# Altium schematic sheet SH23 - AIC PHONE AIC.SchDoc
size 386 x 246 mm
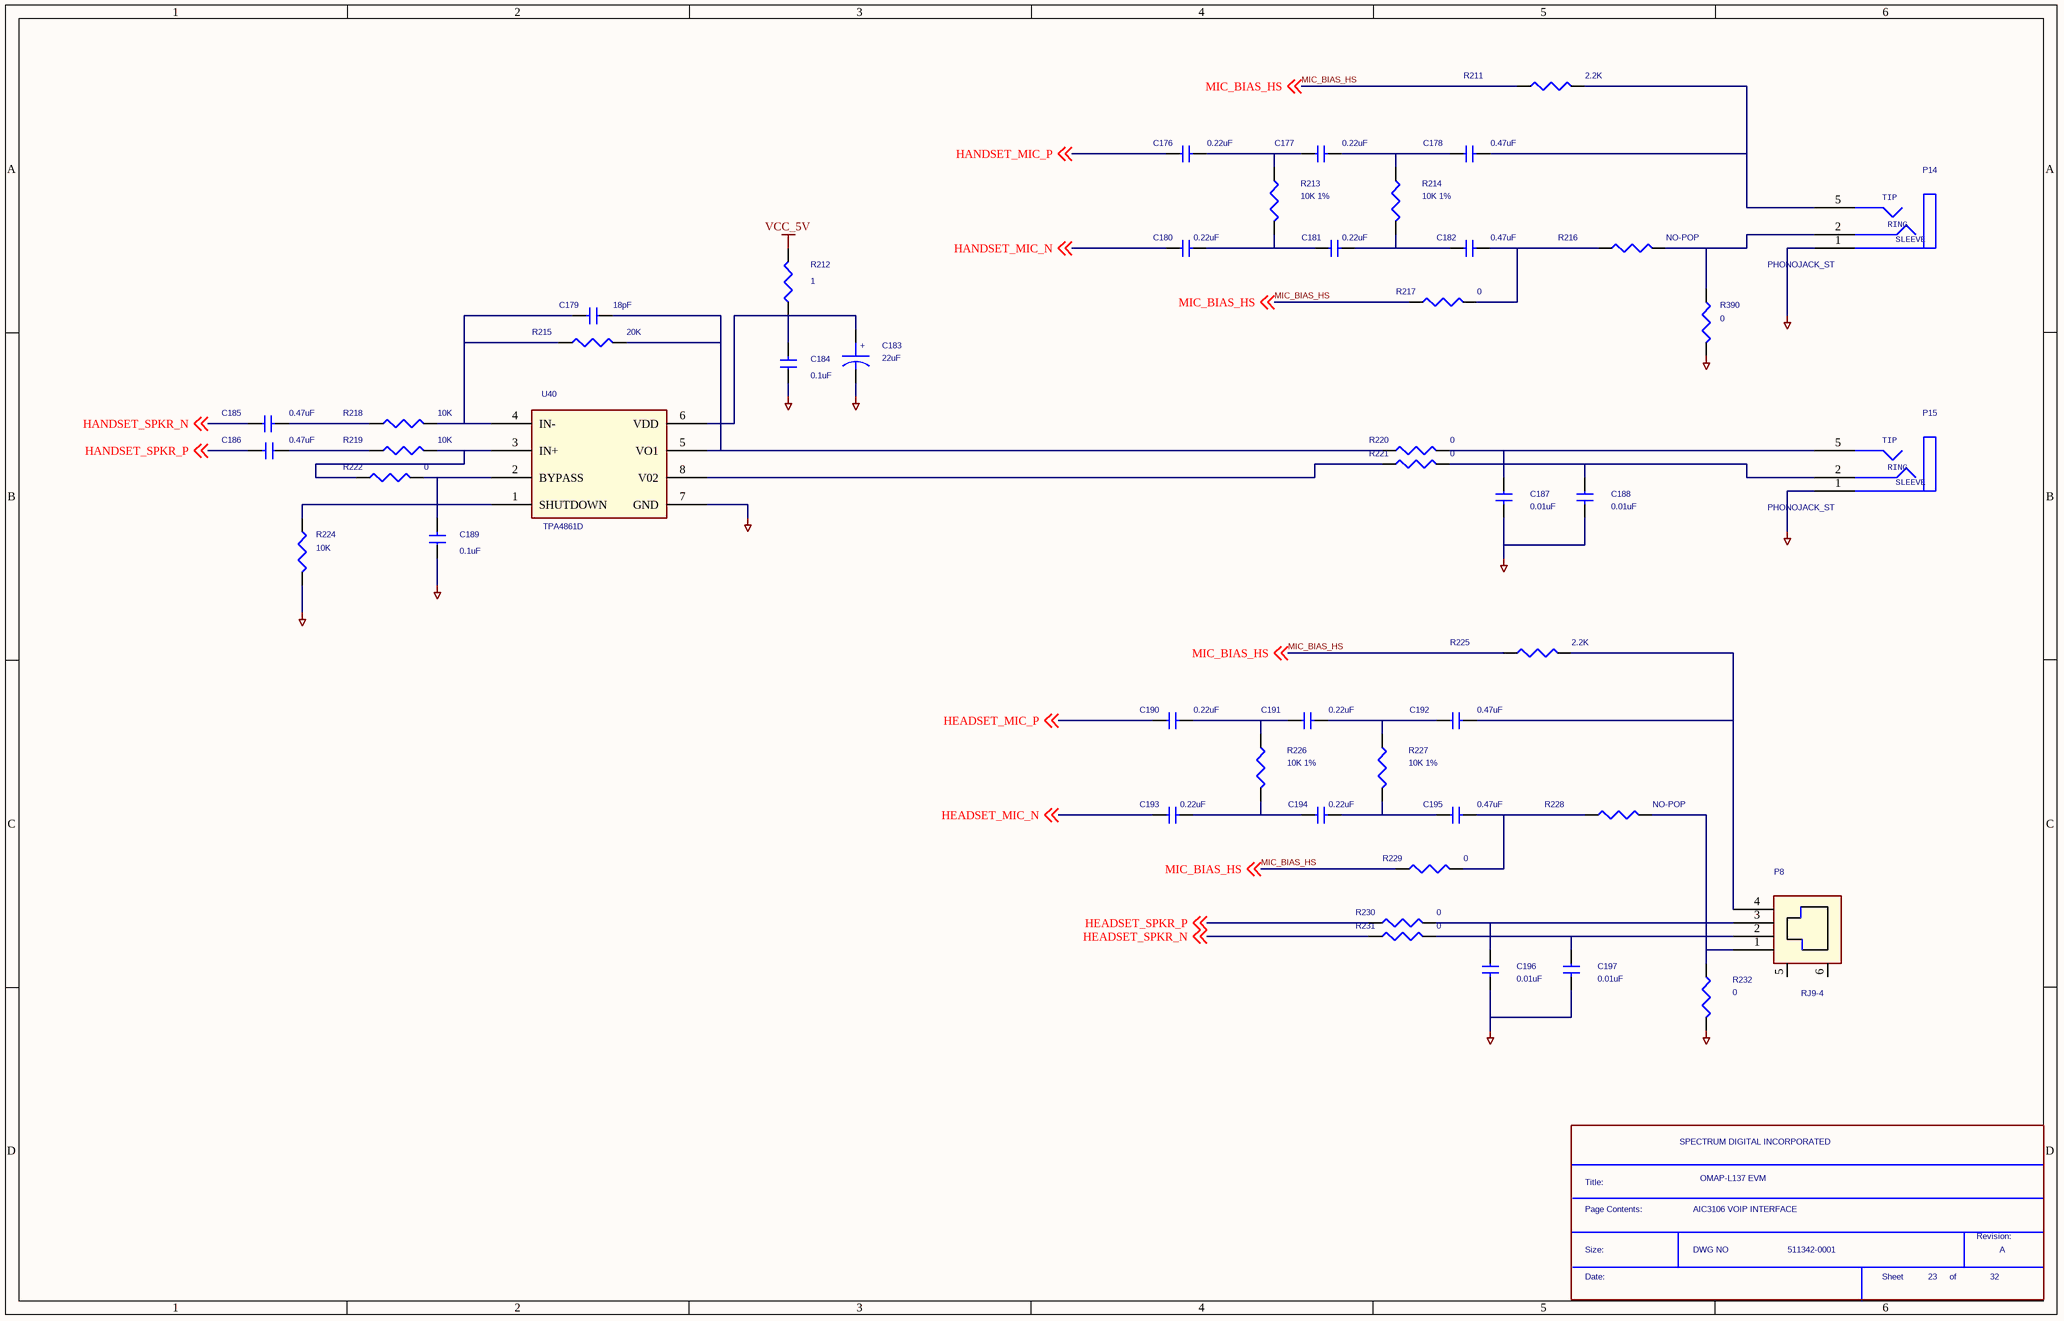
[diagram p0: SH23 - AIC PHONE AIC.SchDoc]

## Parts
*  Page Contents:: AIC3106 VOIP INTERFACE  RevCode: A  Title: OMAP-L137 EVM  OrgName: SPECTRUM DIGITAL INCORPORATED  Doc: 511342-0001  Page Number: 23  Page Count: 32  (hidden comment: SDTitleBlock)  (graphical)
C176  0.22uF  [c603-35x45]
C177  0.22uF  [c603-35x45]
C178  0.47uF  [c603-35x45]
C179  18pF  [c603-35x45]
C180  0.22uF  [c603-35x45]
C181  0.22uF  [c603-35x45]
C182  0.47uF  [c603-35x45]
C183  22uF  [C1206-40X70]
C184  0.1uF  [c402-25]
C185  0.47uF  [c603-35x45]
C186  0.47uF  [c603-35x45]
C187  0.01uF  [c402-25]
C188  0.01uF  [c402-25]
C189  0.1uF  [c402-25]
C190  0.22uF  [c603-35x45]
C191  0.22uF  [c603-35x45]
C192  0.47uF  [c603-35x45]
C193  0.22uF  [c603-35x45]
C194  0.22uF  [c603-35x45]
C195  0.47uF  [c603-35x45]
C196  0.01uF  [c402-25]
C197  0.01uF  [c402-25]
P8  RJ9-4  [molex-52018]
P14  PHONOJACK_ST  [cui3533-10070]
P15  PHONOJACK_ST  [cui3533-10070]
R211  2.2K  [r402-25]
R212  1  [r603-35X45]
R213  10K 1%  [r402-25]
R214  10K 1%  [r402-25]
R215  20K  [r402-25]
R216  NO-POP  [r402-25]
R217  0  [r402-25]
R218  10K  [r402-25]
R219  10K  [r402-25]
R220  0  [r402-25]
R221  0  [r402-25]
R222  0  [r402-25]
R224  10K  [r402-25]
R225  2.2K  [r402-25]
R226  10K 1%  [r402-25]
R227  10K 1%  [r402-25]
R228  NO-POP  [r402-25]
R229  0  [r402-25]
R230  0  [r402-25]
R231  0  [r402-25]
R232  0  [r402-25]
R390  0  [r402-25]
U40  TPA4861D  [so8-25x75]

## Nets
GND_AIC: C183.2 C184.1 C187.2 C188.2 C189.1 C196.2 C197.2 P14.1 P15.1 R224.2 R232.2 R390.2 U40.7(GND)
VCC_5V: R212.2
HANDSET_MIC_N: C180.1 ; off-sheet HANDSET_MIC_N
HANDSET_MIC_P: C176.1 ; off-sheet HANDSET_MIC_P
HANDSET_SPKR_N: C185.1 ; off-sheet HANDSET_SPKR_N
HANDSET_SPKR_P: C186.2 ; off-sheet HANDSET_SPKR_P
HEADSET_MIC_N: C193.1 ; off-sheet HEADSET_MIC_N
HEADSET_MIC_P: C190.1 ; off-sheet HEADSET_MIC_P
HEADSET_SPKR_N: R231.1 ; off-sheet HEADSET_SPKR_N
HEADSET_SPKR_P: R230.1 ; off-sheet HEADSET_SPKR_P
MIC_BIAS_HS: R211.1 R217.1 R225.1 R229.1 ; off-sheet MIC_BIAS_HS
NetC176_2: C176.2 C177.1 R213.1
NetC177_2: C177.2 C178.1 R214.1
NetC178_2: C178.2 P14.5 R211.2
NetC179_1: C179.1 R215.2 R220.1 U40.5(VO1)
NetC179_2: C179.2 R215.1 R218.2 U40.4(IN-)
NetC180_2: C180.2 C181.1 R213.2
NetC181_2: C181.2 C182.1 R214.2
NetC182_2: C182.2 R216.1 R217.2
NetC183_1: C183.1 C184.2 R212.1 U40.6(VDD)
NetC185_2: C185.2 R218.1
NetC186_1: C186.1 R219.1
NetC187_1: C187.1 P15.5 R220.2
NetC188_1: C188.1 P15.2 R221.2
NetC189_2: C189.2 R222.2 U40.2(BYPASS)
NetC190_2: C190.2 C191.1 R226.1
NetC191_2: C191.2 C192.1 R227.1
NetC192_2: C192.2 P8.4 R225.2
NetC193_2: C193.2 C194.1 R226.2
NetC194_2: C194.2 C195.1 R227.2
NetC195_2: C195.2 R228.1 R229.2
NetC196_1: C196.1 P8.3 R230.2
NetC197_1: C197.1 P8.2 R231.2
NetP8_1: P8.1 R228.2 R232.1
NetP14_2: P14.2 R216.2 R390.1
NetR219_2: R219.2 R222.1 U40.3(IN+)
NetR221_1: R221.1 U40.8(V02)
NetR224_1: R224.1 U40.1(SHUTDOWN)

Not connected (* = marked no-connect by the designer): P8 5 6

## Notes on the sheet
- (in symbol CAPACITOR POL_0) +
- (in symbol PHONOJACK_ST_1) TIP; RING; SLEEVE
- (in symbol SDTitleBlock) Title:; Page Contents:; Revision:; Size:; DWG NO; Date:; Sheet; of

## Library data of the parts
C176 C177 C180 C181 C190 C191 C193 C194 = CAP NP_1: Part #: 101005-1220R
C178 C182 C185 C186 C192 C195 = CAP NP_1: Part #: 101007-1470R
C179 = CAP NP_1: Part #: 101103-1184R
C183 = CAPACITOR POL_0: Part #: 101064-0221R
C184 C189 = CAP NP_1: Part #: 101587-1100R
C187 C188 C196 C197 = CAP NP_1: Part #: 101587-1101R
P8 = RJ11-4_0: Part #: 100057-0001
P14 P15 = PHONOJACK_ST_1
R211 R225 = R_0: Part #: 101370-2202R
R212 = R: Part #: 100687-0100R
R213 R214 R226 R227 = R_0: Part #: 102145-1003R
R215 = R: Part #: 101370-2003R
R216 R228 = R_0: Part #: R0402-NOPOP
R217 R220 R221 R229-R232 = R_0: Part #: 101370-0001R
R218 R219 R224 = R: Part #: 101370-1003R
R222 R390 = R: Part #: 101370-0001R
U40 = TPA4861D: Part #: 100962-0001R